# Altium schematic sheet VCO.SchDoc
size A4; SheetNumber: 2; SheetTotal: 5
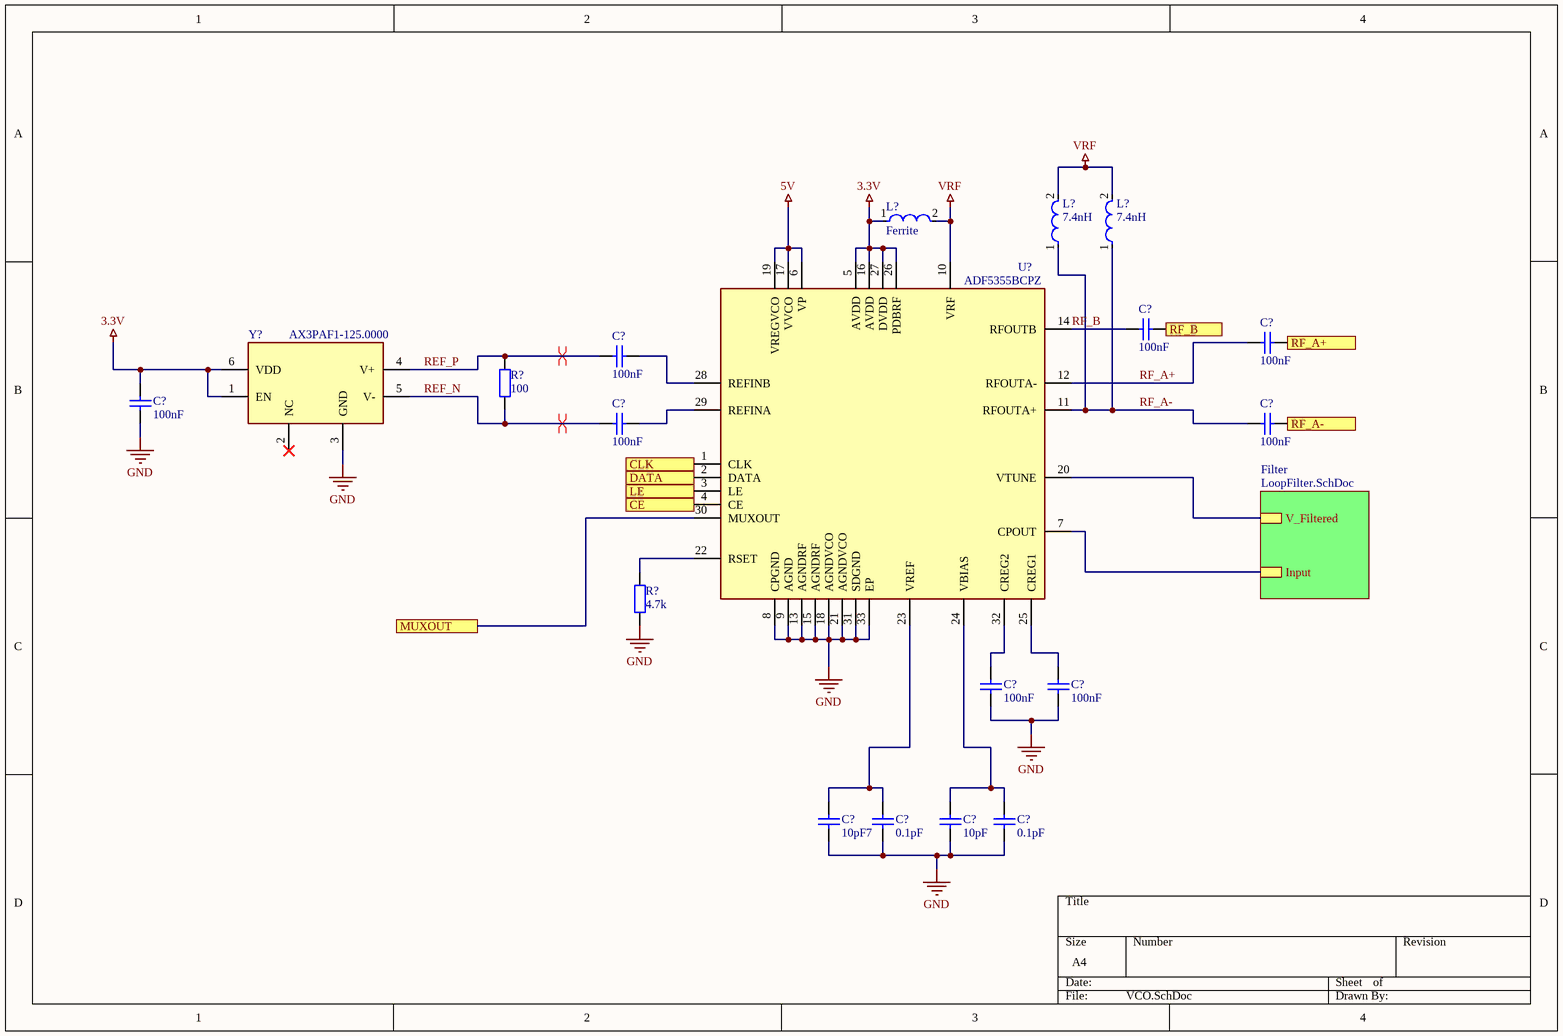
[diagram p0: VCO.SchDoc]

## Parts
(Parts that share a designator on the sheet are numbered #1, #2 ... from top to bottom, then left to right.)
C?#1  100nF  [CAP_0402]
C?#2  100nF  [CAP_0402]
C?#3  100nF  [CAP_0402]
C?#4  100nF  [CAP_0402]
C?#5  100nF  [CAP_0402]
C?#6  100nF  [CAP_0402]
C?#7  100nF  [CAP_0402]
C?#8  100nF  [CAP_0402]
C?#9  10pF7  [CAP_0402]
C?#10  0.1pF  [CAP_0402]
C?#11  10pF  [CAP_0402]
C?#12  0.1pF  [CAP_0402]
L?#1  Ferrite  [FP-LQW18AN_00-MFG]
L?#2  7.4nH  [FP-LQW18AN_00-MFG]
L?#3  7.4nH  [FP-LQW18AN_00-MFG]
R?#1  100  [Res_0402]
R?#2  4.7k  [Res_0402]
U?  ADF5355BCPZ  [QFN50P500X500X80-33N-D]
Y?  AX3PAF1-125.0000  [AX3_3.2x2.5]

## Sub-sheets
Filter = LoopFilter.SchDoc: Input, V_Filtered

## Ports
CE, CLK, DATA, LE, MUXOUT, RF_A+, RF_A-, RF_B

## Nets
3.3V: C?#4.2 L?#1.1 U?.5(AVDD) U?.16(AVDD) U?.26(PDBRF) U?.27(DVDD) Y?.1(EN) Y?.6(VDD)
5V: U?.6(VP) U?.17(VVCO) U?.19(VREGVCO)
GND: C?#4.1 C?#7.1 C?#8.1 C?#9.1 C?#10.1 C?#11.1 C?#12.1 R?#2.1 U?.8(CPGND) U?.9(AGND) U?.13(AGNDRF) U?.15(AGNDRF) U?.18(AGNDVCO) U?.21(AGNDVCO) U?.31(SDGND) U?.33(EP) Y?.3(GND)
VRF: L?#1.2 L?#2.2 L?#3.2 U?.10(VRF)
CE: U?.4(CE) ; port CE
CLK: U?.1(CLK) ; port CLK
DATA: U?.2(DATA) ; port DATA
LE: U?.3(LE) ; port LE
MUXOUT: U?.30(MUXOUT) ; port MUXOUT
REF_N: C?#5.2 R?#1.1 Y?.5(V-)
REF_P: C?#3.2 R?#1.2 Y?.4(V+)
RF_A+: C?#2.2 U?.12(RFOUTA-)
RF_A+: C?#2.1 ; port RF_A+  [a separate net that carries the same name]
RF_A-: C?#6.2 L?#2.1 L?#3.1 U?.11(RFOUTA+)
RF_A-: C?#6.1 ; port RF_A-  [a separate net that carries the same name]
RF_B: C?#1.2 U?.14(RFOUTB)
RF_B: C?#1.1 ; port RF_B  [a separate net that carries the same name]
NetC?#3_1: C?#3.1 U?.28(REFINB)
NetC?#5_1: C?#5.1 U?.29(REFINA)
NetC?#7_2: C?#7.2 U?.32(CREG2)
NetC?#8_2: C?#8.2 U?.25(CREG1)
NetC?#9_2: C?#9.2 C?#10.2 U?.23(VREF)
NetC?#11_2: C?#11.2 C?#12.2 U?.24(VBIAS)
NetR?#2_2: R?#2.2 U?.22(RSET)
NetU?_7: U?.7(CPOUT) ; sheet Filter/Input
NetU?_20: U?.20(VTUNE) ; sheet Filter/V_Filtered

Not connected (* = marked no-connect by the designer): Y? 2(NC)*

## Layout directives
differential pair: REF_N, REF_P

## Library data of the parts
C?#1-C?#12 = Capacitor: Manufacturer: Murata; Part Number: GRM155R71E103KA01D
L?#1 = Ferrite_bead: Test Frequency: 100MHz; DC Current: 500mA; Current: 400mA; Series Resistance: 170mR; Tolerance: 2%; Core Material: Non-Magnetic; Shielding: Unshielded; Self Resonant Frequency: 4.6GHz; Inductance: 22nH; Q Factor: 40; Weight: 0.000106oz; Military Standard: Not; Case/Package: 0603; Case Code (Metric): 1608; Width: 0.8mm; Length: 1.6mm; Depth: 1mm; REACH SVHC: No SVHC; Case Code (Imperial): 0603; Lead Free: Lead Free; Mount: Surface Mount; Resistor Type: Wirewound; Inductance Tolerance: 2%; Number of Pins: 2; Termination: SMD/SMT; Package Quantity: 4000; Height - Seated (Max): 0.039inch; Height: 0.8mm; Packaging: Tape and Reel; Max DC Current: 500mA; Current Rating: 500mA; Min Operating Temperature: -55°C; DC Resistance (DCR): 170mR; Max Operating Temperature: 125°C
L?#2 L?#3 = Inductor: Test Frequency: 100MHz; DC Current: 500mA; Current: 400mA; Series Resistance: 170mR; Tolerance: 2%; Core Material: Non-Magnetic; Shielding: Unshielded; Self Resonant Frequency: 4.6GHz; Inductance: 22nH; Q Factor: 40; Weight: 0.000106oz; Military Standard: Not; Case/Package: 0603; Case Code (Metric): 1608; Width: 0.8mm; Length: 1.6mm; Depth: 1mm; REACH SVHC: No SVHC; Case Code (Imperial): 0603; Lead Free: Lead Free; Mount: Surface Mount; Resistor Type: Wirewound; Inductance Tolerance: 2%; Number of Pins: 2; Termination: SMD/SMT; Package Quantity: 4000; Height - Seated (Max): 0.039inch; Height: 0.8mm; Packaging: Tape and Reel; Max DC Current: 500mA; Current Rating: 500mA; Min Operating Temperature: -55°C; DC Resistance (DCR): 170mR; Max Operating Temperature: 125°C
R?#1 R?#2 = Resistor_EU
U? = ADF5355BCPZ: Integrated Circuit; Manufacturer_Name: Analog Devices; Datasheet Link: https://componentsearchengine.com/Datasheets/2/ADF5355BCPZ.pdf; Height: 0.8mm; Manufacturer_Part_Number: ADF5355BCPZ; Mouser Part Number: 584-ADF5355BCPZ; Mouser Price/Stock: https://www.mouser.co.uk/ProductDetail/Analog-Devices/ADF5355BCPZ?qs=hpwIUhX6lWz%252By8O4aZ7X5w%3D%3D; Arrow Part Number: ADF5355BCPZ; Arrow Price/Stock: https://www.arrow.com/en/products/adf5355bcpz/analog-devices
Y? = AX3PAF1-125.0000: Crystal or Oscillator; Manufacturer_Name: ABRACON; Datasheet Link: https://abracon.com/datasheets/AX3.pdf; Manufacturer_Part_Number: AX3PAF1-125.0000; Mouser Part Number: 815-AX3PAF1-125.0000; Mouser Price/Stock: https://www.mouser.co.uk/ProductDetail/ABRACON/AX3PAF1-1250000?qs=Zz7%252BYVVL6bFYJKyZSka0MA%3D%3D